# Altium project Eln1Project.PrjPcb
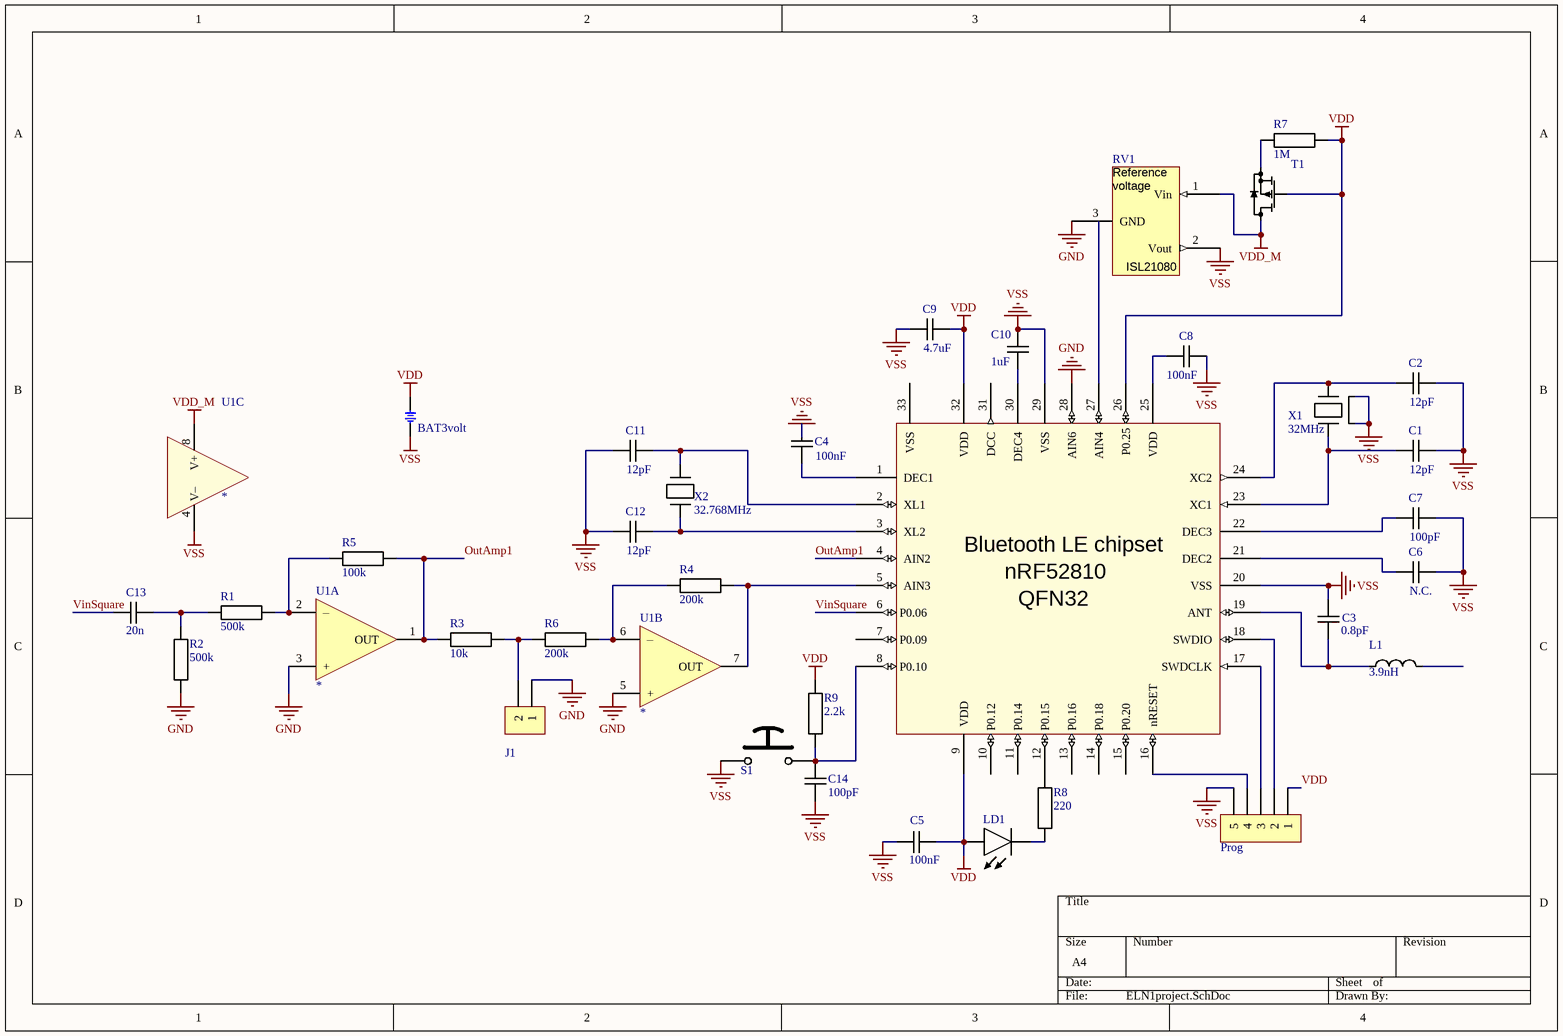
[diagram p0: ELN1project.SchDoc]
PcbDate: dd.mm.yyyy; PcbDesigner: Alexandre & Kenny; PcbRevision: 1.0; SchematicDate: dd.mm.yyyy; SchematicDesigner: Alexandre & Kenny; SchematicRevision: 1.0
1 sheet, 35 parts. Net scope: global (net labels, ports and power ports of the same name join across sheets).
Board file: Eln1Project.PcbDoc

## Sheet ELN1project.SchDoc: AK Team - Humidity sensor
size A4

### Parts
*  Component_1  [QFN50P500X500X90_HS-33N]  (value not drawn)
BT?  BAT3volt  [BTH2032]
C1  value 12pF  [CAPACITOR 1005 REFLOW]
C2  value 12pF  [CAPACITOR 1005 REFLOW]
C3  value 0.8pF  [CAPACITOR 1005 REFLOW]
C4  value 100nF  [CAPACITOR 1005 REFLOW]
C5  value 100nF  [CAPACITOR 1005 REFLOW]
C6  value N.C.  [CAPACITOR 1005 REFLOW]
C7  value 100pF  [CAPACITOR 1005 REFLOW]
C8  value 100nF  [CAPACITOR 1005 REFLOW]
C9  value 4.7uF  [CAPACITOR 1005 REFLOW]
C10  value 1uF  [CAPACITOR 1608 REFLOW]
C11  value 12pF  [CAPACITOR 1005 REFLOW]
C12  value 12pF  [CAPACITOR 1005 REFLOW]
C13  20n  [CAPACITOR 0603 REFLOW]
C14  100pF  [CAPACITOR 0603 REFLOW]
J1  *  [PinHeader1x2 P1.27]  (value not drawn)
L1  3.9nH  [INDUCTOR 1005 REFLOW]
LD1  *  [LED 1608 REFLOW]  (value not drawn)
Prog  *  [PinHeader1x5 P1.27]  (value not drawn)
R1  500k  [RESISTOR 0603 REFLOW]
R2  500k  [RESISTOR 0603 REFLOW]
R3  10k  [RESISTOR 0603 REFLOW]
R4  200k  [RESISTOR 0603 REFLOW]
R5  100k  [RESISTOR 0603 REFLOW]
R6  200k  [RESISTOR 0603 REFLOW]
R7  1M  [RESISTOR 0603 REFLOW]
R8  220  [RESISTOR 0603 REFLOW]
R9  2.2k  [RESISTOR 0603 REFLOW]
RV1  VoltageReference  [ISL21080]  (value not drawn)
S1  *  [Push Button C2.5X3.0 OMRON B3U-1000P(M)-B]  (value not drawn)
T1  *  [SOT23 P0.95 C1.6x3.0 H1.3]  (value not drawn)
U1  *  [MSOP8 P0.65 C3.0X3.0 H1.1]  (parts A,B,C of 3)
X1  32MHz  [Crystal C2.0x1.6 Abracon ABM11W]
X2  value 32.768MHz  [Crystal C3.2x1.5 Abracon ABS07]

### Nets
GND: *.28(AIN6) J1.1 R2.1 RV1.3(GND) U1.3(+) U1.5(+)
VDD: *.9(VDD) *.26(P0.25) *.32(VDD) BT?.1 C5.1 C9.2 LD1.2(A) Prog.1 R7.2 R9.2 T1.1(G)
VDD_M: RV1.1(Vin) T1.3(D) U1.8(V+)
VSS: *.20(VSS) *.29(VSS) BT?.2 C1.2 C2.2 C3.1 C4.2 C5.2 C6.2 C7.2 C8.2 C9.1 C10.2 C11.1 C12.1 C14.1 Prog.5 RV1.2(Vout) S1.1 U1.4(V–) X1.2 X1.4
OutAmp1: *.4(AIN2) R3.1 R5.2 U1.1(OUT)
VinSquare: *.6(P0.06) C13.1
Net*_1: *.1(DEC1) C4.1
Net*_2: *.2(XL1) C11.2 X2.1
Net*_3: *.3(XL2) C12.2 X2.2
Net*_5: *.5(AIN3) R4.2 U1.7(OUT)
Net*_8: *.8(P0.10) C14.2 R9.1 S1.2
Net*_12: *.12(P0.15) R8.2
Net*_16: *.16(nRESET) Prog.4
Net*_17: *.17(SWDCLK) Prog.3
Net*_18: *.18(SWDIO) Prog.2
Net*_19: *.19(ANT) C3.2 L1.1
Net*_21: *.21(DEC2) C6.1
Net*_22: *.22(DEC3) C7.1
Net*_23: *.23(XC1) C1.1 X1.1
Net*_24: *.24(XC2) C2.1 X1.3
Net*_25: *.25(VDD) C8.1
Net*_30: *.30(DEC4) C10.1
NetC13_2: C13.2 R1.1 R2.2
NetJ1_2: J1.2 R3.2 R6.1
NetLD1_1: LD1.1(C) R8.1
NetR1_2: R1.2 R5.1 U1.2(–)
NetR4_1: R4.1 R6.2 U1.6(–)
NetR7_1: R7.1 T1.2(S)

Not connected (* = marked no-connect by the designer): * 7(P0.09) 10(P0.12) 11(P0.14) 13(P0.16) 14(P0.18) 15(P0.20) 27(AIN4) 31(DCC) 33(VSS); L1 2

### Notes on the sheet
- (in symbol Component_1) Bluetooth LE chipset; nRF52810; QFN32
- (in symbol VoltageReference) Reference; voltage; ISL21080

### Library data of the parts
BT? = BATH_CR2032: BATTERY HOLDER, CR2032; VALUE: BAT3volt; MANF_P#: -; .: http://www.chila.ir
C1-C14 = Capacitor
  C13: Value: 20n
  C14: Value: 100pF
J1 = PinHeader1x2: Plug connector; Value: *
L1 = Inductor: Value: 3.9nH
LD1 = LED: LED generic; Value: *
Prog = PinHeader1x5: Plug connector; Value: *
R1-R9 = Resistor
  R1 R2: Value: 500k
  R3: Value: 10k
  R4 R6: Value: 200k
  R5: Value: 100k
  R7: Value: 1M
  R8: Value: 220
  R9: Value: 2.2k
S1 = Push Button 2Pins: Push Button, 2 pins; Value: *
T1 = MOS-P SOT23 G-S-D: Generic MOS-P; Value: *
U1 = OPA DUAL: Generic dual OPA 8 pins; Value: *
X1 = Crystal C2.0x1.6 Abracon ABM11W: Value: 32MHz
X2 = Crystal C3.2x1.5 Abracon ABS07